# Altium project Power stage of Solar Robot.PrjPcb
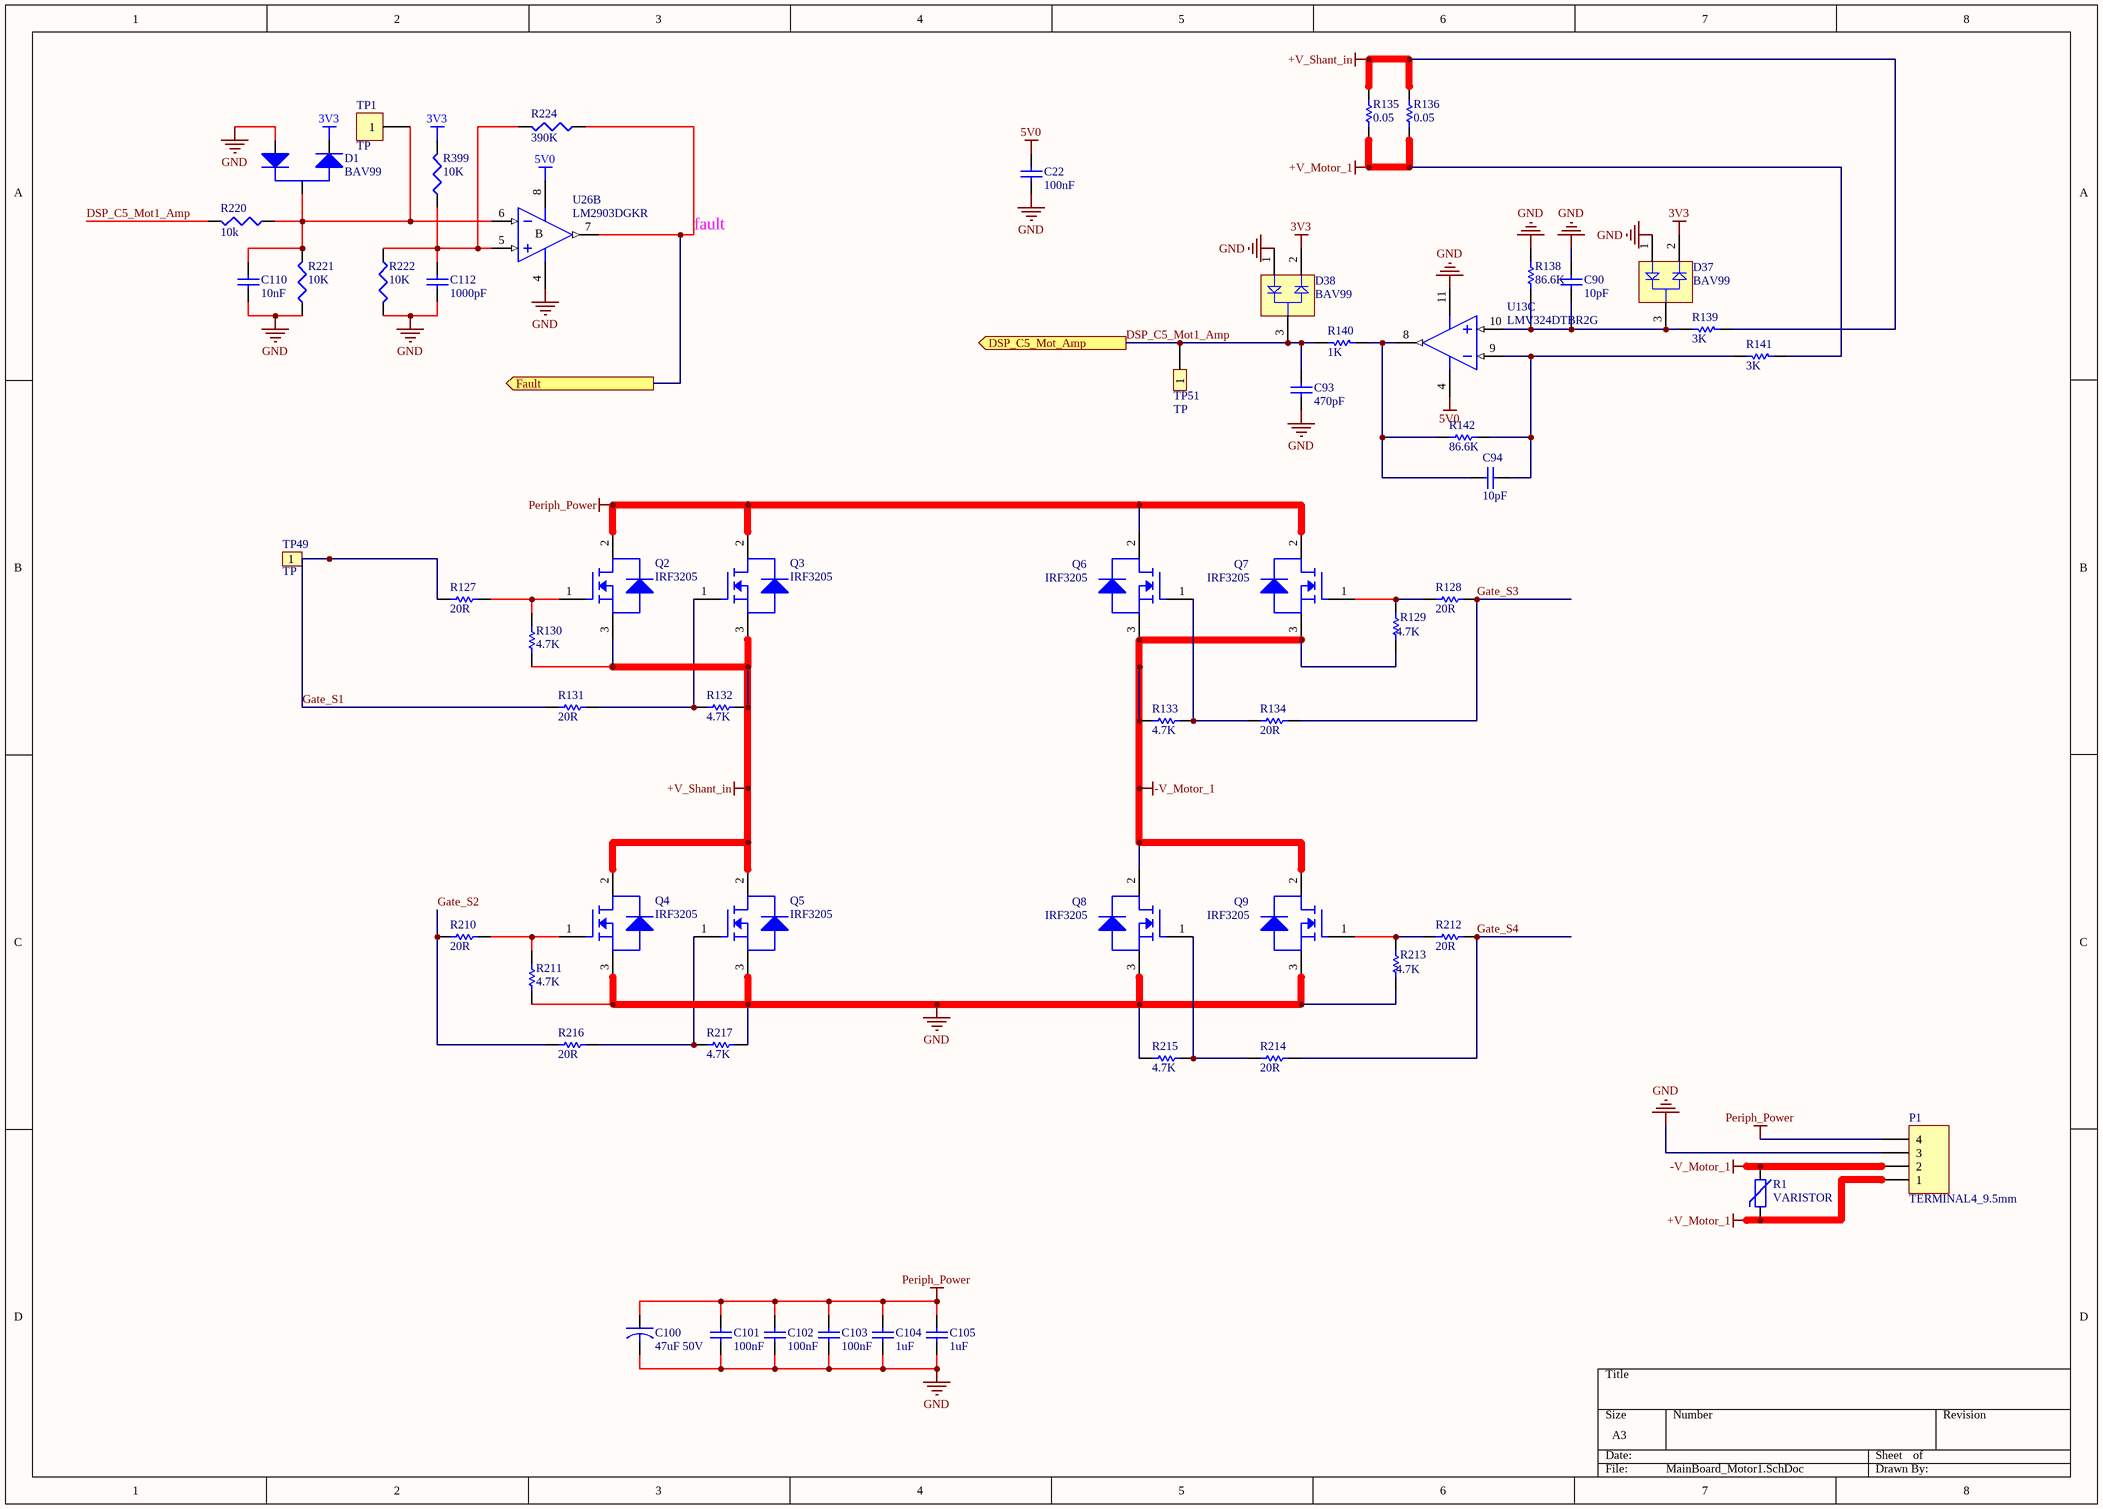
[diagram p0: MainBoard_Motor1.SchDoc]
3 sheets, 194 parts. Net scope: flat (ports and power ports of the same name join across sheets).
Board file: Solar Power Stage-V1.00.PcbDoc
Sheets:
  MainBoard_Motor1.SchDoc
  MainBoard_Motor2.SchDoc
  MainBoard_Motor3.SchDoc

## Sheet MainBoard_Motor1.SchDoc
size A3

### Parts
C22  100nF  [C0603]
C90  10pF  [C0603]
C93  470pF  [C0603]
C94  10pF  [C0603]
C100  47uF 50V  [RB-SGF-6.3MM]
C101  100nF  [C0805]
C102  100nF  [C0805]
C103  100nF  [C0805]
C104  1uF  [C0805]
C105  1uF  [C0805]
C110  10nF  [0603-C-PW]
C112  1000pF  [0603-C-PW]
D1  BAV99  [SOT-23-PW]
D37  BAV99  [SOT-23]
D38  BAV99  [SOT-23]
P1  TERMINAL4_9.5mm  [Terminal 9.5mm_4]
Q2  IRF3205  [TO-220]
Q3  IRF3205  [TO-220]
Q4  IRF3205  [TO-220]
Q5  IRF3205  [TO-220]
Q6  IRF3205  [TO-220]
Q7  IRF3205  [TO-220]
Q8  IRF3205  [TO-220]
Q9  IRF3205  [TO-220]
R1  VARISTOR  [VARISTOR]
R127  20R  [R1206]
R128  20R  [R1206]
R129  4.7K  [R0805]
R130  4.7K  [R0805]
R131  20R  [R1206]
R132  4.7K  [R0805]
R133  4.7K  [R0805]
R134  20R  [R1206]
R135  0.05  [2512]
R136  0.05  [2512]
R138  86.6K  [R0603]
R139  3K  [R0603]
R140  1K  [R0603]
R141  3K  [R0603]
R142  86.6K  [R0603]
R210  20R  [R1206]
R211  4.7K  [R0805]
R212  20R  [R1206]
R213  4.7K  [R0805]
R214  20R  [R1206]
R215  4.7K  [R0805]
R216  20R  [R1206]
R217  4.7K  [R0805]
R220  10k  [0603-R-PW]
R221  10K  [0603-R-PW]
R222  10K  [0402-R-PW]
R224  390K  [0603-R-PW]
R399  10K  [0603-R-PW]
TP1  TP  [TP-SMD-1MM]
TP49  TP  [TP_1mm]  (no BOM)
TP51  TP  [TP_1mm]  (no BOM)
U13  LMV324DTBR2G  [SO-14]  (part C of 4)
U26  LM2903DGKR  [TSSOP_8-PW]  (part B of 2)

### Ports
DSP_C5_Mot_Amp (out), Fault (out)

### Nets
3V3: D1.2(K) D37.2(K2) D38.2(K2) R399.2
5V0: C22.2 U13.4(V+) U26.8(V+)  [project net +5V]
+V_Motor_1: P1.1 R1.2 R135.2 R136.2 R141.1
+V_Shant_in: Q2.3(S) Q3.3(S) Q4.2(D) Q5.2(D) R130.1 R132.1 R135.1 R136.1 R139.1
-V_Motor_1: P1.2 Q6.3(S) Q7.3(S) Q8.2(D) Q9.2(D) R1.1 R129.1 R133.2
GND: C22.1 C90.2 C93.1 C100.2 C101.1 C102.1 C103.1 C104.1 C105.1 C110.1 C112.1 D1.1(A) D37.1(A1) D38.1(A1) P1.3 Q4.3(S) Q5.3(S) Q8.3(S) Q9.3(S) R138.2 R211.1 R213.1 R215.2 R217.1 R221.1 R222.1 U13.11(V-) U26.4(V-)
Periph_Power: C100.1 C101.2 C102.2 C103.2 C104.2 C105.2 P1.4 Q2.2(D) Q3.2(D) Q6.2(D) Q7.2(D)  [project net vdcpo]
DSP_C5_Mot1_Amp: C93.2 D38.3(C) R140.1 R220.2 TP51.1 ; port DSP_C5_Mot_Amp
fault: R224.2 U26.7(OUT) ; port Fault
Gate_S1: R127.1 R131.1 TP49.1
Gate_S2: R210.1 R216.1
Gate_S3: R128.2 R134.2
Gate_S4: R212.2 R214.2
NetC90_1: C90.1 D37.3(C) R138.1 R139.2 U13.10(INC+)
NetC94_1: C94.1 R140.2 R142.1 U13.8(OUTC)
NetC94_2: C94.2 R141.2 R142.2 U13.9(INC-)
NetC110_2: C110.2 D1.3(AK) R220.1 R221.2 TP1.1 U26.6(IN-)
NetC112_2: C112.2 R222.2 R224.1 R399.1 U26.5(IN+)
NetQ2_1: Q2.1(G) R127.2 R130.2
NetQ3_1: Q3.1(G) R131.2 R132.2
NetQ4_1: Q4.1(G) R210.2 R211.2
NetQ5_1: Q5.1(G) R216.2 R217.2
NetQ6_1: Q6.1(G) R133.1 R134.1
NetQ7_1: Q7.1(G) R128.1 R129.2
NetQ8_1: Q8.1(G) R214.1 R215.1
NetQ9_1: Q9.1(G) R212.1 R213.2

### Notes on the sheet
- (in symbol LM2903DGKR, part B) B

### Library data of the parts
C22 = C0402: Ceramic Chip Capacitor - Standard; Manufacturer: Yageo; MFR PART NO: CC0603KPX7R9BB104; Note: Footprint corresponds to dimensions for bulk cassette packaging. This case size has tightened tolerances.; Published: 17-Jul-2002; LatestRevisionDate: 19-Mar-2004; LatestRevisionNote: Silkscreen size reduced.; DatasheetDocument: Mar-2001; PackageDocument: Mar-2001; PackageReference: 0402; Publisher: Altium Limited; Code_JEITA: 0402; Code_IPC: 1005 [0402]; ComponentLink1Description: Manufacturer Link; ComponentLink1URL: http://www.kemet.com/; ComponentLink2Description: Datasheet; ComponentLink2URL: http://www.kemet.com/kemet/web/homepage/kechome.nsf/vapubfilesname/F3102TA.pdf/$file/F3102TA.pdf; Value: 100nF
C90 C94 = Cap_510pF_50V_0603: Cap_10pF_5%_C0G_50V_0603; Manufacturer: Yageo; MFR PART NO: CC0603JRNPO9BN510; SAP: 10021841; ComponentLink1Description: Manufacturer Link; ComponentLink1URL: http://www.kemet.com/; ComponentLink2Description: Datasheet; ComponentLink2URL: http://www.kemet.com/kemet/web/homepage/kechome.nsf/vapubfilesname/F3102TA.pdf/$file/F3102TA.pdf
C93 = Cap_470pF_50V_0603: Cap_470pF_5%_C0G_50V_0603; MFR PART NO: CC0603JRNPO9BN471; Manufacturer: Yageo
C100 = Cap_47uF 50V_EL_6.3mm: Cap_47uF 50V_Pitch2.5mm; MFR PART NO: ERS1HM470E11OT; Manufacturer: AIHUA; SAP: 10023070
C101-C103 = Cap_100nF_50V_0805: Cap_100nF_5%_X7R_50V_0805; Manufacturer: VISHAY; MFR PART NO: VJ0805Y104JXAAT; SAP: 10010690
C104 C105 = Cap_1uF_50V_0805: Cap_1uF_20%_X5R_50V_0805; MFR PART NO: UMK212BJ105MGHT; Manufacturer: Taiyo Yuden; SAP: 10021804
C110 = Cap: CAP CER 10000PF 50V X7R 0603; Manufacturer: Yageo; MFR PART NO: AC0603KPX7R9BB103; Value: MKP63 472M 300~Y2-4.7nF; Published: 8-Jun-2000; LatestRevisionDate: 17-Jul-2002; LatestRevisionNote: Re-released for DXP Platform.; PackageReference: RAD-0.3; Publisher: Altium Limited; PackageDescription: Radial Cap, Thru-Hole; 2 Leads; 0.3 in Pin Spacing
C112 = Cap: CAP CER 1000PF 50V X7R 0603; Manufacturer: Yageo; MFR PART NO: CC0603KRX7R9BB102; Value: MKP63 472M 300~Y2-4.7nF; Published: 8-Jun-2000; LatestRevisionDate: 17-Jul-2002; LatestRevisionNote: Re-released for DXP Platform.; PackageReference: RAD-0.3; Publisher: Altium Limited; PackageDescription: Radial Cap, Thru-Hole; 2 Leads; 0.3 in Pin Spacing
D1 = BAV99: DIODE ARRAY GP 100V 215MA SOT23; Manufacturer: Nexperia; MFR PART NO: BAV99,215
D37 D38 = BAV99: Dِiode_BAV99_A7W_SOT23; Manufacturer: Diode Incorporated; MFR PART NO: BAV99-7-F; Green: TRUE; Packing: Reel; PackageVersion: Apr-08; PackageReference: SOT23; PackageDescription: 3-Pin Small Outline Transistor Package, 1.3 x 2.9 mm Body, 0.95 mm Pitch; Supplier 1: Arrow; Supplier Part Number 1: 8_hDx09NysxyY_EZJdaSbs5L1p9U5ut-2MaZMQWGOaA; Supplier 2: Farnell; Supplier Part Number 2: 1056504RL; Supplier 3: Farnell; Supplier Part Number 3: 1056504; Mounting Technology: Surface Mount; ComponentLink1Description: Manufacturer URL; ComponentLink1URL: http://www.infineon.com/; ComponentLink2Description: Datasheet; ComponentLink2URL: http://www.infineon.com/dgdl/bav99series.pdf?folderId=db3a30431400ef6801141b5844e103ea&fileId=db3a30431400ef6801141c1b237d042f; ComponentLink3Description: Package Specification; ComponentLink3URL: http://www.infineon.com/dgdl/smbta14_mmbta14.pdf?folderId=db3a30431441fb5d011445c30f210183&fileId=db3a30431441fb5d011445ef0201018c
P1 = TERMINAL4_9.5mm: T44-9.5mm_4; Manufacturer: Cixi Kefa Elec; MFR PART NO: KF45C-9-5-4P
Q2-Q9 = MOS_IRF3205: MOSFET N-CHANNEL_ 55V_ TO-220; Manufacturer: International Rectifier; MFR PART NO: IRF3205
R1 = VARISTOR: 35V 2cm; Manufacturer: TDK Epcos; MFR PART NO: B72220S0350K101
R127 R128 R131 R134 R210 R212 R214 R216 = Res_20R_1206: Res_20R_1%_0.25W_1206; Manufacturer: Yageo; MFR PART NO: RC1206FR-0720RL; SAP: 10021877
R129 R130 R132 R133 R211 R213 R215 R217 = Res_4.7K_0805: Res_4.7K_1%_0805; Manufacturer: Yageo; MFR PART NO: RC0805FR-074K7L; SAP: 10021870
R135 R136 = Res_0.05_2512: Res_0.05_1%_2512; Manufacturer: Bourns Inc.; MFR PART NO: CRA2512-FZ-R050ELF
R138 R142 = Res_86.6K_0603: Res_86.6K_1%_0603; Manufacturer: Yageo; MFR PART NO: AC0603FR-0786K6L
R139 R141 = Res_3K_0603: Res_3K_1%_0603; Manufacturer: Yageo; MFR PART NO: RC0603FR-073KL; SAP: 10016031
R140 = ERAV: RES SMD 1K OHM 1% 1/10W 0603; Manufacturer: Yageo; MFR PART NO: RC0603FR-071KL; Note: If flow soldering, adjust pad width of PCB Footprint to 0.7 - 0.8 times the width of the resistor.; Published: 17-Dec-2003; LatestRevisionDate: 19-Mar-2004; LatestRevisionNote: Silkscreen size reduced.; PackageDocument: Mar-2003; PackageReference: ERA-0603; Publisher: Altium Limited; Code_IPC: 1608 [0603]; ComponentLink1Description: Manufacturer Link; ComponentLink1URL: http://www.panasonic.com/industrial/components/resistive_products.htm; ComponentLink2Description: Datasheet; ComponentLink2URL: http://www.panasonic.com/industrial/components/pdf/AOF0000CE1.pdf; VALUE: 1K
R220 = RES1: RES SMD 47K OHM 1% 1/10W 0603; Manufacturer: Yageo; MFR PART NO: RC0603FR-0747KL
R221 = RES1: RES SMD 3.9K OHM 1% 1/10W 0603; Manufacturer: Yageo; MFR PART NO: RC0603FR-073K9L
R222 = RES1: RES SMD 11K OHM 1% 1/16W 0402; Manufacturer: Yageo; MFR PART NO: RC0402FR-0711KL
R224 = RES1: Res Thick Film 0603 390K Ohm 1% 0.1W; Manufacturer: Yageo; MFR PART NO: AC0603FR-07390KL
R399 = RES1: RES, THICK FILM, 4K7, 1%, 0.1W, 0603; Manufacturer: Yageo; MFR PART NO: RC0603FR-134K7L
TP1 = Header 1: Header, 1-Pin; LatestRevisionDate: 17-Jul-2002; LatestRevisionNote: Re-released for DXP Platform.; Publisher: Altium Limited
TP49 TP51 = TEST-POINT: LatestRevisionDate: 17-Jul-2002; LatestRevisionNote: Re-released for DXP Platform.; Publisher: Altium Limited
U13 = LMV324DTBR2G: IC_OpAmp_Quad_TSSOP-14; Manufacturer: On Semiconductor; GBW Typ (MHz): 1; Packing: Tape and Reel; VCC Max (V): 5.5; VCC Min (V): 2.7; DatasheetVersion: Rev. 10; PackageVersion: Rev. B, 10/2006; PackageReference: TSSOP-14-948G-01; PackageDescription: 14-Pin Small Outline Package, Body 5 x 4.4 mm, Pitch 0.65 mm; Supplier 1: Digi-Key; Supplier Part Number 1: LMV324DTBR2G-ND; Supplier 2: Newark; Supplier Part Number 2: 01P4987; Supplier 3: Mouser; Supplier Part Number 3: 863-LMV324DTBR2G; RoHS: TRUE; SR Typ (V/uS): 1; Mounting Technology: Surface Mount; PartNumber: LMV324DTBR2G; ComponentLink1Description: Manufacturer URL; ComponentLink1URL: http://www.onsemi.com/; ComponentLink2Description: Datasheet; ComponentLink2URL: http://www.onsemi.cn/pub_link/Collateral/LMV321-LMV358-LMV324-D.PDF; ComponentLink3Description: Package Specification; ComponentLink3URL: http://www.onsemi.com/pub_link/Collateral/948G-01.PDF; MFR PART NO: LMV324DTBR2G
U26 = LM2903DGKR: IC DUAL DIFF COMPARATOR 8VSSOP; Manufacturer: Texas Instruments; Published: 24-Aug-2001; LatestRevisionDate: 06-Jun-2005; LatestRevisionNote: Stylized 3D Model Added.; DatasheetVersion: Jun-1998; PackageReference: DIP8; Publisher: Altium Limited; PackageDescription: DIP; 8 Leads; Row Spacing 7.62 mm; Pitch 2.54 mm; Code_JEDEC: MO-001-AN; ComponentLink1Description: Manufacturer Link; ComponentLink1URL: http://www.st.com/; ComponentLink2Description: Datasheet; ComponentLink2URL: http://www.st.com/stonline/products/literature/ds/2163/lm358.pdf; MFR PART NO: LM2903DGKR

## Sheet MainBoard_Motor2.SchDoc
size A3
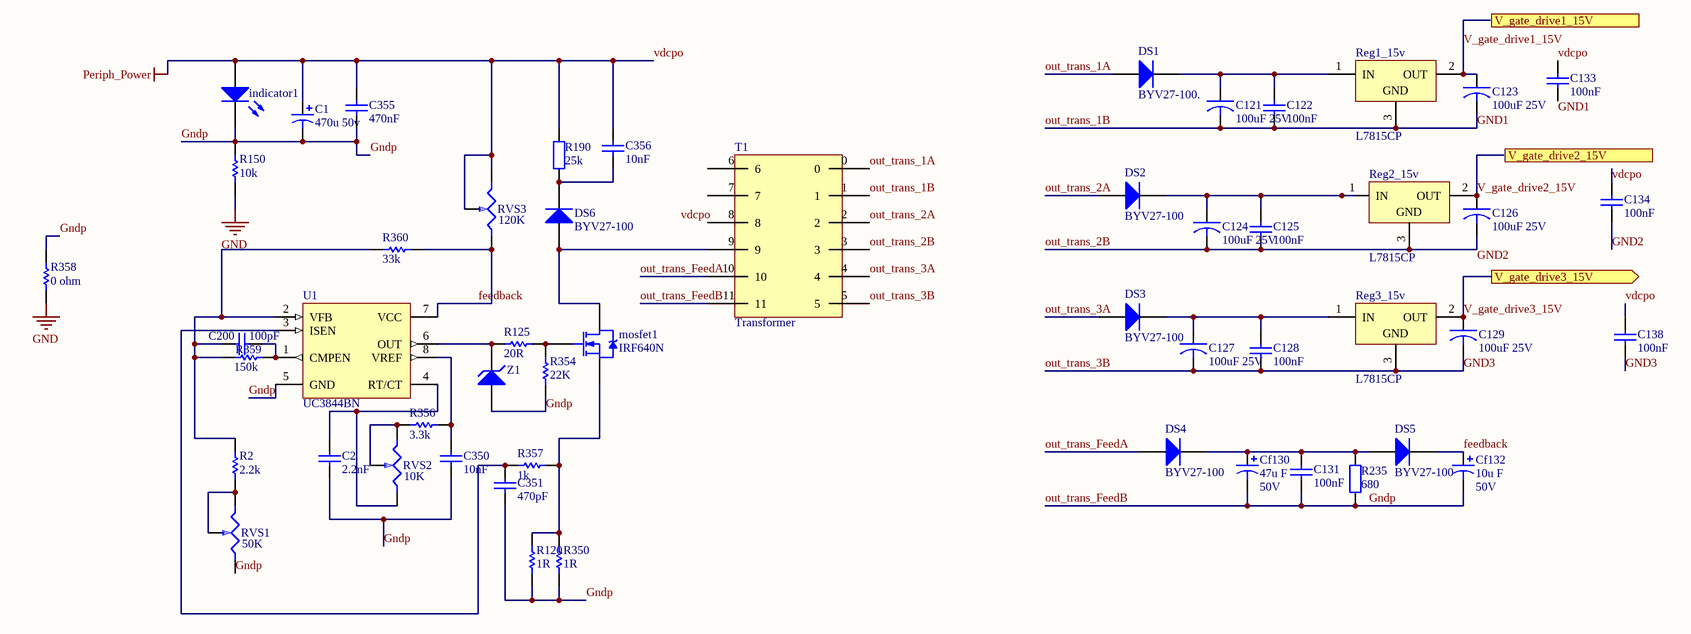
[diagram p1: MainBoard_Motor2.SchDoc]

### Parts
C1  470u 50v  [CAPPR5-5x5]
C2  2.2nF  [C0805]
C121  100uF 25V  [CAP_E_6.3x9_2.5]
C122  100nF  [C0805]
C123  100uF 25V  [CAP_E_6.3x9_2.5]
C124  100uF 25V  [CAP_E_6.3x9_2.5]
C125  100nF  [C0805]
C126  100uF 25V  [CAP_E_6.3x9_2.5]
C127  100uF 25V  [CAP_E_6.3x9_2.5]
C128  100nF  [C0805]
C129  100uF 25V  [CAP_E_6.3x9_2.5]
C131  100nF  [C0805]
C133  100nF  [C0805]
C134  100nF  [C0805]
C138  100nF  [C0805]
C200  100pF  [C0805]
C350  10nF  [C0805]
C351  470pF  [C0805]
C355  470nF  [C0805]
C356  10nF  [C0805]
Cf130  47u F  value 50V  [B]
Cf132  10u F  value 50V  [B]
DS1  BYV27-100.  [DO-41]
DS2  BYV27-100  [DO-41]
DS3  BYV27-100  [DO-41]
DS4  BYV27-100  [DO-41]
DS5  BYV27-100  [DO-41]
DS6  BYV27-100  [DO-41]
indicator1  GREEN  [LED_0805_GREEN]  (value not drawn)
mosfet1  IRF640N  [TO-220AB]
R2  2.2k  [R0805]
R120  1R  [R1206]
R125  20R  [R1206]
R150  10k  [R1206]
R190  25k  [AXIAL-0.6]
R235  680  [AXIAL-0.5]
R350  1R  [R1206]
R354  22K  [R0805]
R356  3.3k  [R0805]
R357  1k  [R0805]
R358  0 ohm  [R0805]
R359  150k  [R1206]
R360  33k  [R1206]
Reg1_15v  L7815CP  [TO220VW]
Reg2_15v  L7815CP  [TO220VW]
Reg3_15v  L7815CP  [TO220VW]
RVS1  50K  [VR5]
RVS2  10K  [VR5]
RVS3  120K  [VR5]
T1  Transformer
U1  UC3844BN  [626-05]
Z1  D Zener  [DO-35]  (value not drawn)

### Ports
V_gate_drive1_15V (out), V_gate_drive2_15V (out), V_gate_drive3_15V (out)

### Nets
GND: R150.1 R358.1
V_gate_drive3_15V: C129.1 Reg3_15v.2(OUT) ; port V_gate_drive3_15V
vdcpo: C1.1 C133.2 C134.2 C138.2 C355.2 C356.2 indicator1.1(A) R190.2 RVS3.1(A) RVS3.2(WIPER)  [also labelled Periph_Power]
feedback: Cf132.1 DS5.2(K) R360.2 RVS3.3(B) U1.7(VCC)
GND1: C121.2 C122.1 C123.2 Reg1_15v.3(GND) T1.1  [also labelled out_trans_1B]
GND2: C134.1
GND3: C127.2 C128.1 C129.2 C138.1 Reg3_15v.3(GND) T1.5  [also labelled out_trans_3B]
Gndp: C1.2 C2.1 C131.1 C350.1 C351.1 C355.1 Cf130.2 Cf132.2 indicator1.2(K) R120.2 R150.2 R235.1 R350.2 R354.1 R358.2 RVS1.3(B) T1.11 U1.5(GND) Z1.1(A)  [also labelled out_trans_FeedB]
out_trans_1A: DS1.1(A) T1.0
out_trans_2A: DS2.1(A) T1.2
out_trans_2B: C124.2 C125.1 C126.2 Reg2_15v.3(GND) T1.3
out_trans_3A: DS3.1(A) T1.4
out_trans_FeedA: DS4.1(A) T1.10
V_gate_drive1_15V: C123.1 Reg1_15v.2(OUT)
V_gate_drive2_15V: C126.1 Reg2_15v.2(OUT)
NetC2_2: C2.2 RVS2.3(B) U1.4(RT/CT)
NetC121_1: C121.1 C122.2 DS1.2(K) Reg1_15v.1(IN)
NetC124_1: C124.1 C125.2 DS2.2(K) Reg2_15v.1(IN)
NetC127_1: C127.1 C128.2 DS3.2(K) Reg3_15v.1(IN)
NetC131_2: C131.2 Cf130.1 DS4.2(K) DS5.1(A) R235.2
NetC200_1: C200.1 R2.2 R359.1 R360.1 U1.2(VFB)
NetC200_2: C200.2 R359.2 U1.1(CMPEN)
NetC350_2: C350.2 R356.2 U1.8(VREF)
NetC351_2: C351.2 R357.1 U1.3(ISEN)
NetC356_1: C356.1 DS6.2(K) R190.1
NetDS6_1: DS6.1(A) mosfet1.2(D) T1.9
Netmosfet1_1: mosfet1.1(G) R125.2 R354.2
Netmosfet1_3: mosfet1.3(S) R120.1 R350.1 R357.2
NetR2_1: R2.1 RVS1.1(A) RVS1.2(WIPER)
NetR125_1: R125.1 U1.6(OUT) Z1.2(K)
NetR356_1: R356.1 RVS2.1(A) RVS2.2(WIPER)

Not connected (* = marked no-connect by the designer): C133 1; T1 6 7 8

### Notes on the sheet
- Labels drawn without touching a wire or pin: GND1, GND2, vdcpo

### Library data of the parts
C1 Cf130 Cf132 = Cap Pol1: Polarized Capacitor (Radial); Published: 8-Jun-2000; LatestRevisionDate: 17-Jul-2002; LatestRevisionNote: Re-released for DXP Platform.; PackageReference: RB7.6-15; Publisher: Altium Limited
C2 = Cap_10nF_50V_0805: Cap_2.2nF_10%_X7R_50V_0805; Manufacturer: Yageo; MFR PART NO: CC0805KRX7R9BB103; SAP: 10020252
C121 C123 C124 C126 C127 C129 = Cap_100uF 25V_EL_6.3MM: Cap_100uF 25V_Pitch2.5mm; MFR PART NO: ERS1EM101E11OT; Manufacturer: AIHUA
C122 C125 C128 C131 C133 C134 C138 C350 C351 C355 C356 = Cap_10nF_50V_0805: Cap_10nF_10%_X7R_50V_0805; Manufacturer: Yageo; MFR PART NO: CC0805KRX7R9BB103; SAP: 10020252
C200 = Cap_100pF_50V_0805: Cap_100pF_10%_X7R_50V_0805; Manufacturer: Yageo; MFR PART NO: CC0805KRX7R9BB101; SAP: 10020251
DS1-DS5 = Diode 1N4007: 1 Amp General Purpose Rectifier SMD; Published: 8-Jun-2000; LatestRevisionDate: 17-Jul-2002; LatestRevisionNote: Re-released for DXP Platform.; DatasheetDocument: 1998; PackageDocument: Aug-1999; PackageReference: DO-41; Publisher: Altium Limited; Code_JEDEC: DO-204-AL; ComponentLink1Description: Manufacturer Link; ComponentLink1URL: http://www.fairchildsemi.com/; ComponentLink2Description: Datasheet; ComponentLink2URL: http://www.fairchildsemi.com/ds/1N%2F1N4001.pdf
DS6 = Diode 1N4007: 1 Amp General Purpose Rectifier; Published: 8-Jun-2000; LatestRevisionDate: 17-Jul-2002; LatestRevisionNote: Re-released for DXP Platform.; DatasheetDocument: 1998; PackageDocument: Aug-1999; PackageReference: DO-41; Publisher: Altium Limited; Code_JEDEC: DO-204-AL; ComponentLink1Description: Manufacturer Link; ComponentLink1URL: http://www.fairchildsemi.com/; ComponentLink2Description: Datasheet; ComponentLink2URL: http://www.fairchildsemi.com/ds/1N%2F1N4001.pdf
indicator1 = LED3: Typical BLUE SiC LED; Manufacturer: Kingbright; MFR PART NO: APT2012SGC; Published: 8-Jun-2000; LatestRevisionDate: 17-Dec-2003; LatestRevisionNote: PCB Footprint replaced.; DatasheetVersion: 16-Apr-2002; PackageVersion: 16-Apr-2002; PackageReference: 3.5X2.8X1.9; Publisher: Altium Limited; PackageDescription: SM LED; 2 C-Bend Leads; Body 3.5 x 2.8 x 1.9 mm, inc leads (LxWxH typ); Value: GREEN
mosfet1 = IRF640N: HEXFET Power MOSFET; Note: Pin 2 is electrically connected to Tab (Drain).; Published: 17-Sep-2003; DatasheetVersion: 9-Oct-2000; PackageVersion: Feb-1997; PackageReference: TO-220AB; Publisher: Altium Limited; PackageDescription: TO, Thru-Hole, Vertical, Heatsink Mounted; 3 In-Line Leads; Pitch 2.54 mm; ComponentLink1Description: Manufacturer Link; ComponentLink1URL: http://www.irf.com/; ComponentLink2Description: Datasheet; ComponentLink2URL: http://www.irf.com/product-info/datasheets/data/IRL3714.pdf
R2 R356-R358 = Res_4.7K_0805: Res_2.2K_1%_0805; Manufacturer: Yageo; MFR PART NO: RC0805FR-074K7L; SAP: 10021870
R120 R350 = Res_2.2R_1206: Res_2.2R_1%_1206; Manufacturer: Yageo; MFR PART NO: RC1206FR-072R2L; SAP: 10021874
R125 R150 R359 R360 = Res_20R_1206: as R127 on sheet MainBoard_Motor1
R190 R235 = Res2: Resistor; Published: 8-Jun-2000; LatestRevisionDate: 17-Jul-2002; LatestRevisionNote: Re-released for DXP Platform.; PackageReference: AXIAL-0.4; Publisher: Altium Limited
R354 = Res_4.7K_0805: as R129 on sheet MainBoard_Motor1
Reg1_15v Reg2_15v Reg3_15v = L78S05CV: 2A Positive Voltage Regulator; Note: Tab is connected to pin 3 (GND).; Published: 24-Aug-2001; LatestRevisionDate: 17-Jul-2002; LatestRevisionNote: Re-released for DXP Platform.; DatasheetVersion: Jan-1993; PackageVersion: Apr-1998; PackageReference: TO220VW; Publisher: Altium Limited; PackageDescription: TO, Thru-Hole, Vertical, Heatsink Mounted; 3 In-Line Leads; Pitch 2.54 mm; Pin sequence 1, 3, 2; ComponentLink1Description: Manufacturer Link; ComponentLink1URL: http://www.st.com/; ComponentLink2Description: Datasheet; ComponentLink2URL: http://www.st.com/stonline/products/literature/ds/2148/l78s10c.pdf
RVS1-RVS3 = RESISTOR VAR: Text Field1: 40; Text Field2: 20
T1 = Component_1
U1 = UC3844BN: High Performance Current Mode Controller; Published: 15-Apr-2002; DatasheetVersion: 1996; PackageVersion: 1998; PackageReference: 626-05; Publisher: Altium Limited; PackageDescription: DIP; 8 Leads; Row Spacing 7.62 mm; Pitch 2.54 mm; ComponentLink1Description: Manufacturer Link; ComponentLink1URL: http://www.onsemi.com/site/products/taxonomy/0,4438,503,00.html; ComponentLink2Description: Datasheet; ComponentLink2URL: http://www.onsemi.com/pub/Collateral/UC3844B-D.PDF
Z1 = 1N751A: Half Watt Zener; Published: 8-Jun-2000; LatestRevisionDate: 17-Jul-2002; LatestRevisionNote: Re-released for DXP Platform.; DatasheetDocument: 1997; PackageReference: DO-35; Publisher: Altium Limited; Code_JEDEC: DO-204-AH; ComponentLink1Description: Manufacturer Link; ComponentLink1URL: http://www.fairchildsemi.com/; ComponentLink2Description: Datasheet; ComponentLink2URL: http://www.fairchildsemi.com/ds/1N%2F1N747A.pdf

## Sheet MainBoard_Motor3.SchDoc
size A3
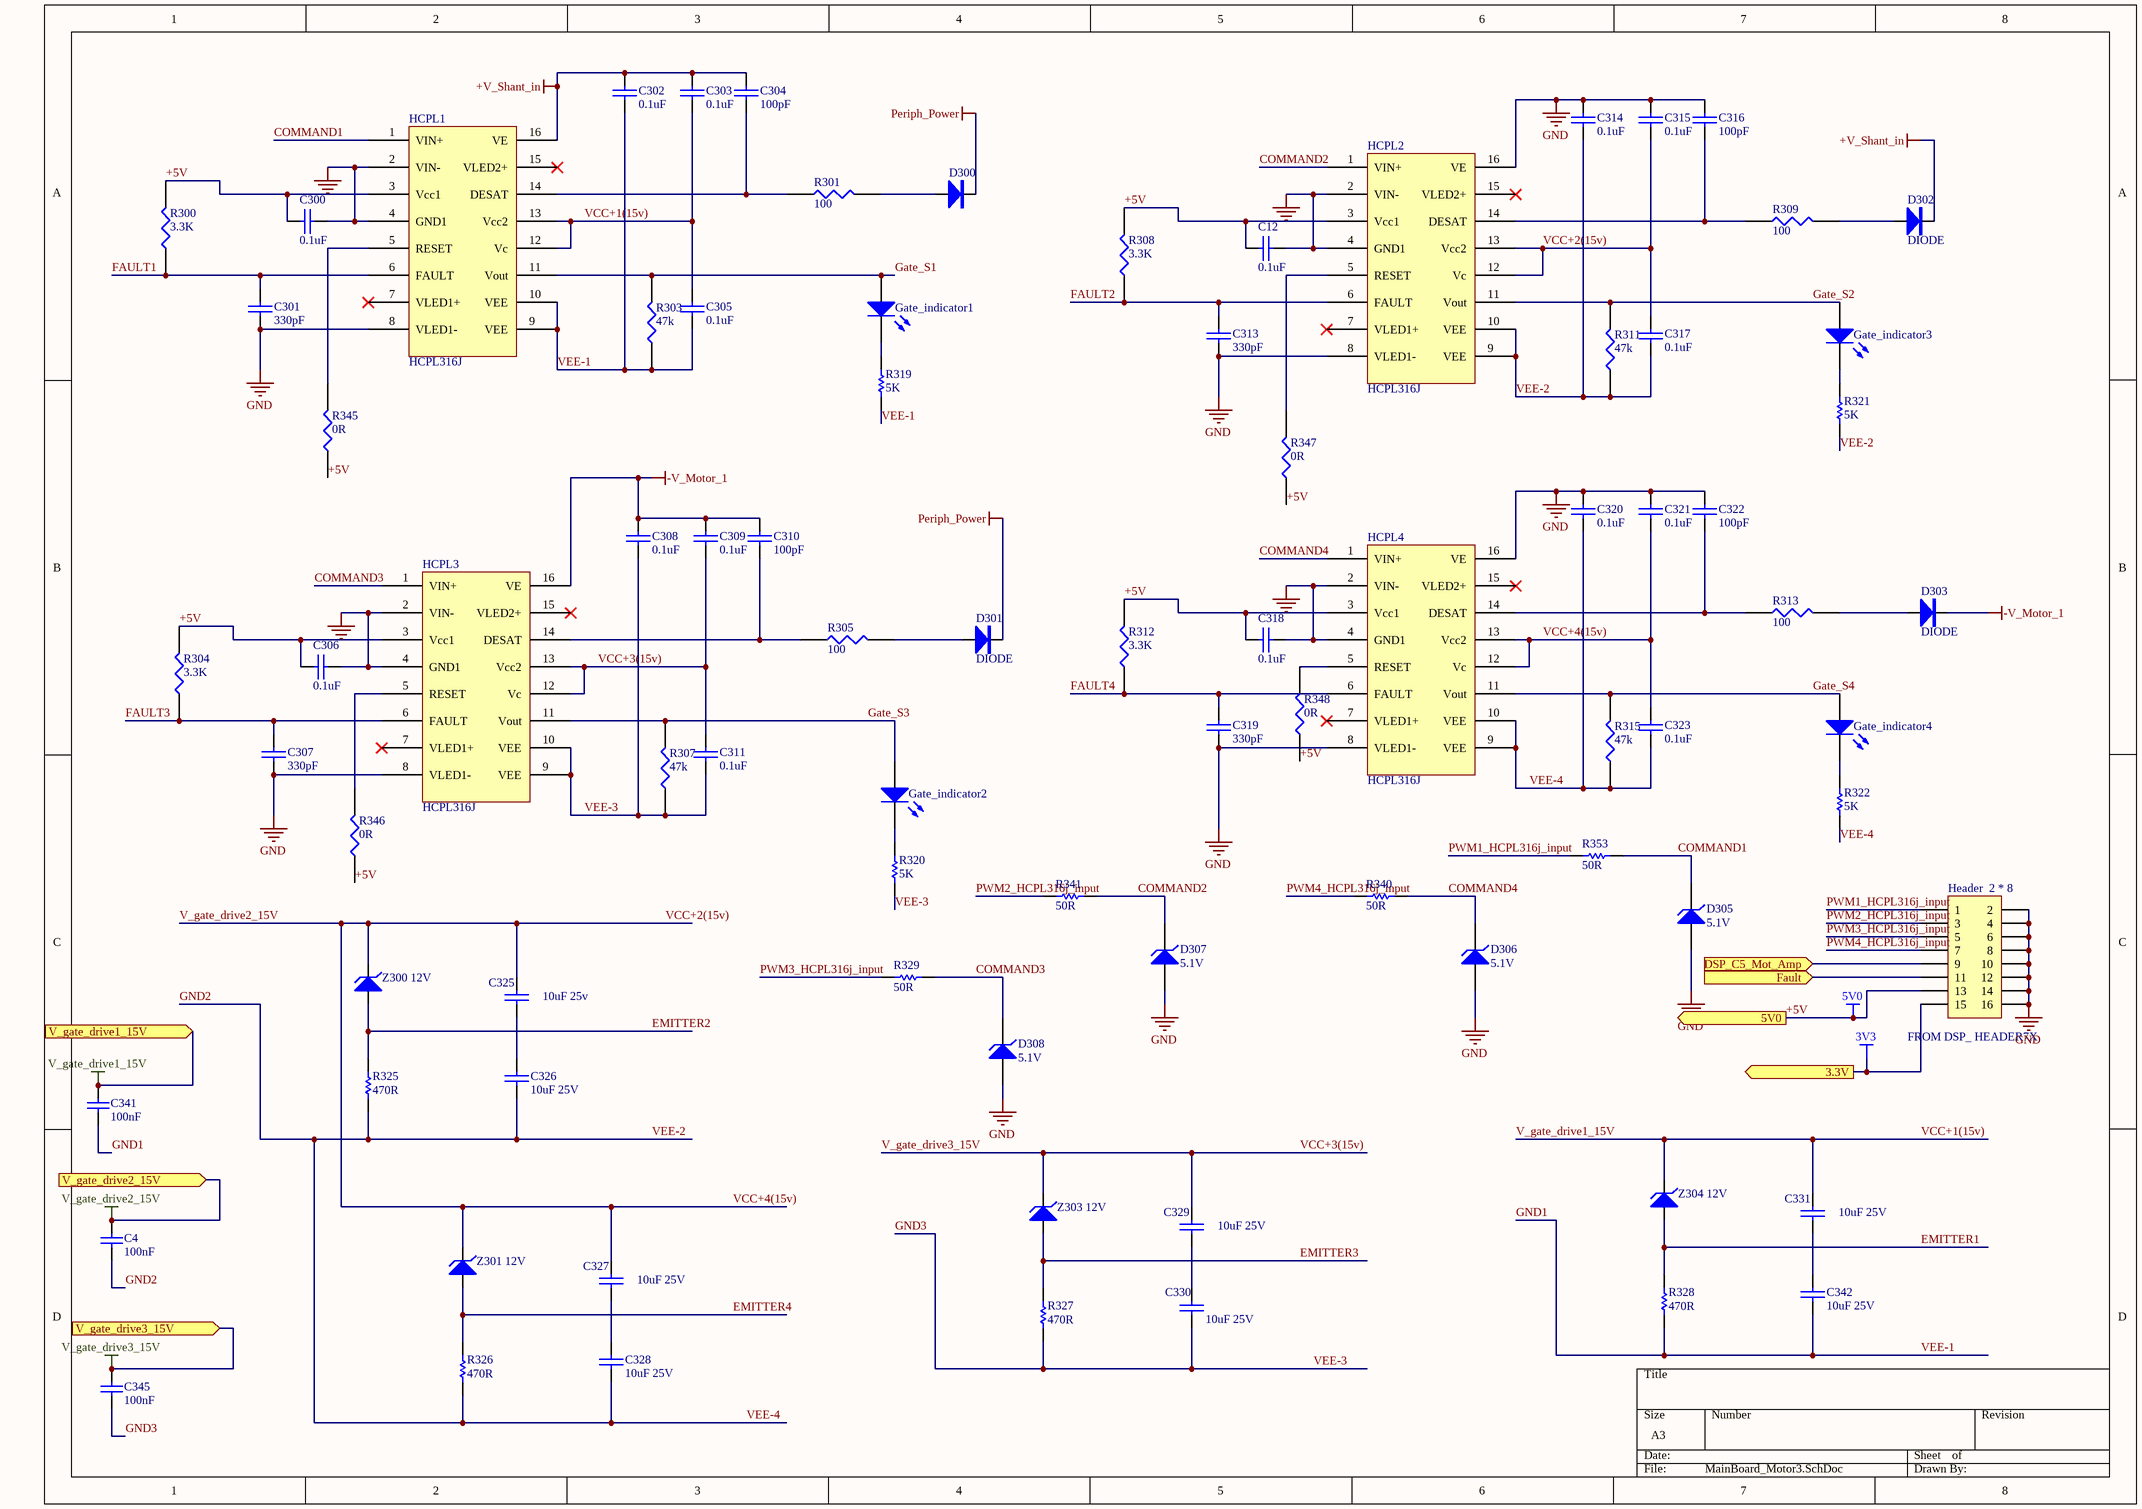
[diagram p2: MainBoard_Motor3.SchDoc]

### Parts
C4  100nF  [C0603]
C12  0.1uF  [1206]
C300  0.1uF  [1206]
C301  330pF  [1206]
C302  0.1uF  [1206]
C303  0.1uF  [1206]
C304  100pF  [1206]
C305  0.1uF  [1206]
C306  0.1uF  [1206]
C307  330pF  [1206]
C308  0.1uF  [1206]
C309  0.1uF  [1206]
C310  100pF  [1206]
C311  0.1uF  [1206]
C313  330pF  [1206]
C314  0.1uF  [1206]
C315  0.1uF  [1206]
C316  100pF  [1206]
C317  0.1uF  [1206]
C318  0.1uF  [1206]
C319  330pF  [1206]
C320  0.1uF  [1206]
C321  0.1uF  [1206]
C322  100pF  [1206]
C323  0.1uF  [1206]
C325  10uF 25v  [CAPACITOR0.1]
C326  10uF 25V  [CAPACITOR0.1]
C327  10uF 25V  [CAPACITOR0.1]
C328  10uF 25V  [CAPACITOR0.1]
C329  10uF 25V  [CAPACITOR0.1]
C330  10uF 25V  [CAPACITOR0.1]
C331  10uF 25V  [CAPACITOR0.1]
C341  100nF  [C0603]
C342  10uF 25V  [CAPACITOR0.1]
C345  100nF  [C0603]
D300  (no value)  [DIODEE]
D301  DIODE  [DIODEE]
D302  DIODE  [DIODEE]
D303  DIODE  [DIODEE]
D305  5.1V  [DO-214AC-PW]
D306  5.1V  [DO-214AC-PW]
D307  5.1V  [DO-214AC-PW]
D308  5.1V  [DO-214AC-PW]
Gate_indicator1  GREEN  [LED_0805_GREEN]  (value not drawn)
Gate_indicator2  GREEN  [LED_0805_GREEN]  (value not drawn)
Gate_indicator3  GREEN  [LED_0805_GREEN]  (value not drawn)
Gate_indicator4  GREEN  [LED_0805_GREEN]  (value not drawn)
HCPL1  HCPL316J  [SO-G16/G6.9]
HCPL2  HCPL316J  [SO-G16/G6.9]
HCPL3  HCPL316J  [SO-G16/G6.9]
HCPL4  HCPL316J  [SO-G16/G6.9]
Header_2_*_8  FROM DSP_ HEADER7X  [HDR2X8]
R300  3.3K  [1206]
R301  100  [1206]
R303  47k  [1206]
R304  3.3K  [1206]
R305  100  [1206]
R307  47k  [1206]
R308  3.3K  [1206]
R309  100  [1206]
R311  47k  [1206]
R312  3.3K  [1206]
R313  100  [1206]
R315  47k  [1206]
R319  5K  [R0603]
R320  5K  [R0603]
R321  5K  [R0603]
R322  5K  [R0603]
R325  470R  [R1206]
R326  470R  [R1206]
R327  470R  [R1206]
R328  470R  [R1206]
R329  50R  [R0805]
R340  50R  [R1206]
R341  50R  [R1206]
R345  0R  [1206]
R346  0R  [1206]
R347  0R  [1206]
R348  0R  [1206]
R353  50R  [R1206]
Z300_12V  (no value)  [DIODEE]
Z301_12V  (no value)  [DIODEE]
Z303_12V  (no value)  [DIODEE]
Z304_12V  (no value)  [DIODEE]

### Ports
3.3V (out), 5V0 (out), DSP_C5_Mot_Amp (in), Fault (in), V_gate_drive1_15V (in), V_gate_drive2_15V (in), V_gate_drive3_15V (in)

### Nets
3V3: Header_2_*_8.15 ; port 3.3V
+5V: C12.1 C300.1 C306.1 C318.1 HCPL1.3(Vcc1) HCPL2.3(Vcc1) HCPL3.3(Vcc1) HCPL4.3(Vcc1) Header_2_*_8.13 R300.2 R304.2 R308.2 R312.2 R345.1 R346.1 R347.1 R348.1 ; port 5V0  [also labelled 5V0]
+V_Shant_in: C302.1 C303.1 C304.1 D302.2(K) HCPL1.16(VE)
-V_Motor_1: C308.1 C309.1 C310.1 D303.2(K) HCPL3.16(VE)
GND: C12.2 C300.2 C301.2 C306.2 C307.2 C313.2 C314.1 C315.1 C316.1 C318.2 C319.2 C320.1 C321.1 C322.1 D305.1(A) D306.1(A) D307.1(A) D308.1(A) HCPL1.2(VIN-) HCPL1.4(GND1) HCPL1.8(VLED1-) HCPL2.2(VIN-) HCPL2.4(GND1) HCPL2.8(VLED1-) HCPL2.16(VE) HCPL3.2(VIN-) HCPL3.4(GND1) HCPL3.8(VLED1-) HCPL4.2(VIN-) HCPL4.4(GND1) HCPL4.8(VLED1-) HCPL4.16(VE) Header_2_*_8.2 Header_2_*_8.4 Header_2_*_8.6 Header_2_*_8.8 Header_2_*_8.10 Header_2_*_8.12 Header_2_*_8.14 Header_2_*_8.16
Periph_Power: D300.2(K) D301.2(K)  [project net vdcpo]
V_gate_drive1_15V: C303.2 C305.1 C331.1 C341.2 HCPL1.12(Vc) HCPL1.13(Vcc2) Z304_12V.2(K) ; port V_gate_drive1_15V  [also labelled VCC+1(15v)]
V_gate_drive2_15V: C4.2 C315.2 C317.1 C321.2 C323.1 C325.1 C327.1 HCPL2.12(Vc) HCPL2.13(Vcc2) HCPL4.12(Vc) HCPL4.13(Vcc2) Z300_12V.2(K) Z301_12V.2(K) ; port V_gate_drive2_15V  [also labelled VCC+2(15v), VCC+4(15v)]
V_gate_drive3_15V: C309.2 C311.1 C329.1 C345.2 HCPL3.12(Vc) HCPL3.13(Vcc2) Z303_12V.2(K) ; port V_gate_drive3_15V  [also labelled VCC+3(15v)]
COMMAND1: D305.2(K) HCPL1.1(VIN+) R353.2
COMMAND2: D307.2(K) HCPL2.1(VIN+) R341.2
COMMAND3: D308.2(K) HCPL3.1(VIN+) R329.2
COMMAND4: D306.2(K) HCPL4.1(VIN+) R340.2
DSP_C5_Mot1_Amp: Header_2_*_8.9 ; port DSP_C5_Mot_Amp
EMITTER1: R328.2 Z304_12V.1(A)
EMITTER2: R325.2 Z300_12V.1(A)
EMITTER3: R327.2 Z303_12V.1(A)
EMITTER4: R326.2 Z301_12V.1(A)
fault: Header_2_*_8.11 ; port Fault
FAULT1: C301.1 HCPL1.6(FAULT) R300.1
FAULT2: C313.1 HCPL2.6(FAULT) R308.1
FAULT3: C307.1 HCPL3.6(FAULT) R304.1
FAULT4: C319.1 HCPL4.6(FAULT) R312.1
Gate_S1: Gate_indicator1.1(A) HCPL1.11(Vout) R303.2
Gate_S2: Gate_indicator3.1(A) HCPL2.11(Vout) R311.2
Gate_S3: Gate_indicator2.1(A) HCPL3.11(Vout) R307.2
Gate_S4: Gate_indicator4.1(A) HCPL4.11(Vout) R315.2
GND1: C302.2 C305.2 C341.1 C342.2 HCPL1.9(VEE) HCPL1.10(VEE) R303.1 R319.1 R328.1  [also labelled VEE-1]
GND2: C4.1 C314.2 C317.2 C320.2 C323.2 C326.2 C328.2 HCPL2.9(VEE) HCPL2.10(VEE) HCPL4.9(VEE) HCPL4.10(VEE) R311.1 R315.1 R321.1 R322.1 R325.1 R326.1  [also labelled VEE-2, VEE-4]
GND3: C308.2 C311.2 C330.2 C345.1 HCPL3.9(VEE) HCPL3.10(VEE) R307.1 R320.1 R327.1  [also labelled VEE-3]
PWM1_HCPL316j_input: Header_2_*_8.1 R353.1
PWM2_HCPL316j_input: Header_2_*_8.3 R341.1
PWM3_HCPL316j_input: Header_2_*_8.5 R329.1
PWM4_HCPL316j_input: Header_2_*_8.7 R340.1
NetC304_2: C304.2 HCPL1.14(DESAT) R301.1
NetC310_2: C310.2 HCPL3.14(DESAT) R305.1
NetC316_2: C316.2 HCPL2.14(DESAT) R309.1
NetC322_2: C322.2 HCPL4.14(DESAT) R313.1
NetC325_2: C325.2 C326.1
NetC327_2: C327.2 C328.1
NetC329_2: C329.2 C330.1
NetC331_2: C331.2 C342.1
NetD300_1: D300.1(A) R301.2
NetD301_1: D301.1(A) R305.2
NetD302_1: D302.1(A) R309.2
NetD303_1: D303.1(A) R313.2
NetGate_indicator1_2: Gate_indicator1.2(K) R319.2
NetGate_indicator2_2: Gate_indicator2.2(K) R320.2
NetGate_indicator3_2: Gate_indicator3.2(K) R321.2
NetGate_indicator4_2: Gate_indicator4.2(K) R322.2
NetHCPL1_5: HCPL1.5(RESET) R345.2
NetHCPL2_5: HCPL2.5(RESET) R347.2
NetHCPL3_5: HCPL3.5(RESET) R346.2
NetHCPL4_5: HCPL4.5(RESET) R348.2

Not connected (* = marked no-connect by the designer): HCPL1 7(VLED1+)* 15(VLED2+)*; HCPL2 7(VLED1+)* 15(VLED2+)*; HCPL3 7(VLED1+)* 15(VLED2+)*; HCPL4 7(VLED1+)* 15(VLED2+)*

### Library data of the parts
C4 C341 C345 = Cap_100nF_50V_0603: Cap_100nF_10%_X7R_50V_0603; Manufacturer: Yageo; MFR PART NO: CC0603KPX7R9BB104; SAP: 10021427
C12 C300 C302 C303 C305 C306 C308 C309 C311 C314 C315 C317 C318 C320 C321 C323 = CAP: Cap_0.1uF_10%_X7R_50V_0805
C301 C307 C313 C319 = CAP: Cap_330pF_10%_X7R_50V_0805
C304 C310 C316 C322 = CAP: Cap_100pF_10%_X7R_50V_0805
C325-C331 C342 = CAP: Capacitor
D300 = 100HF100PV: Diode
D305-D308 = D Zener: DIODE ZENER 5V 1.25W DO214AC; MFR PART NO: BZG05C3V3; Manufacturer: ON Semiconductor; Published: 8-Jun-2000; LatestRevisionDate: 17-Jul-2002; LatestRevisionNote: Re-released for DXP Platform.; PackageReference: DIODE-0.7; Publisher: Altium Limited; PackageDescription: Diode, Thru-Hole; 2 Leads; 0.7 in Pin Spacing
Gate_indicator1-Gate_indicator4 = LED3: as indicator1 on sheet MainBoard_Motor2; Published: 8-Jun-2000; LatestRevisionDate: 17-Dec-2003; LatestRevisionNote: PCB Footprint replaced.; DatasheetVersion: 16-Apr-2002; PackageVersion: 16-Apr-2002; PackageReference: 3.5X2.8X1.9; Publisher: Altium Limited; PackageDescription: SM LED; 2 C-Bend Leads; Body 3.5 x 2.8 x 1.9 mm, inc leads (LxWxH typ); Value: GREEN
Header_2_*_8 = Header 8X2: Header, 8-Pin, Dual row; LatestRevisionDate: 17-Jul-2002; LatestRevisionNote: Re-released for DXP Platform.; Publisher: Altium Limited
R300 R304 R308 R312 = RES1: Res_3.3k_1%_0.25W_805
R301 R309 = RES1: Res_100R_1%_0.25W_1206
R303 R307 R311 = RES1: Res_47k_1%_0.25W_1206
R305 R313 R315 = RES1
R319-R322 = Res_3.3K_0603: Res_3.3K_1%_0603; Manufacturer: Yageo; MFR PART NO: RC0603FR-073K3L; SAP: 10016022
R325-R328 R340 R341 R353 = Res_20R_1206: as R127 on sheet MainBoard_Motor1
R329 = Res_4.7K_0805: as R129 on sheet MainBoard_Motor1
R345-R348 = RES1: Res_0 ohm_1%_0.25W_805
Z300_12V Z301_12V Z303_12V Z304_12V = 1N4728: Zener Diode

## Nets that join several sheets
3V3: MainBoard_Motor1 (D1.2 D37.2 D38.2 R399.2), MainBoard_Motor3 (Header_2_*_8.15)
+5V: MainBoard_Motor1 (C22.2 U13.4 U26.8), MainBoard_Motor3 (17 pins)
+V_Shant_in: MainBoard_Motor1 (9 pins), MainBoard_Motor3 (5 pins)
-V_Motor_1: MainBoard_Motor1 (8 pins), MainBoard_Motor3 (5 pins)
GND: MainBoard_Motor1 (28 pins), MainBoard_Motor2 (R150.1 R358.1), MainBoard_Motor3 (40 pins)
V_gate_drive3_15V: MainBoard_Motor2 (C129.1 Reg3_15v.2), MainBoard_Motor3 (7 pins)
vdcpo: MainBoard_Motor1 (11 pins), MainBoard_Motor2 (10 pins), MainBoard_Motor3 (D300.2 D301.2)
DSP_C5_Mot1_Amp: MainBoard_Motor1 (5 pins), MainBoard_Motor3 (Header_2_*_8.9)
fault: MainBoard_Motor1 (R224.2 U26.7), MainBoard_Motor3 (Header_2_*_8.11)